# Altium schematic sheet PoE.SchDoc
size B
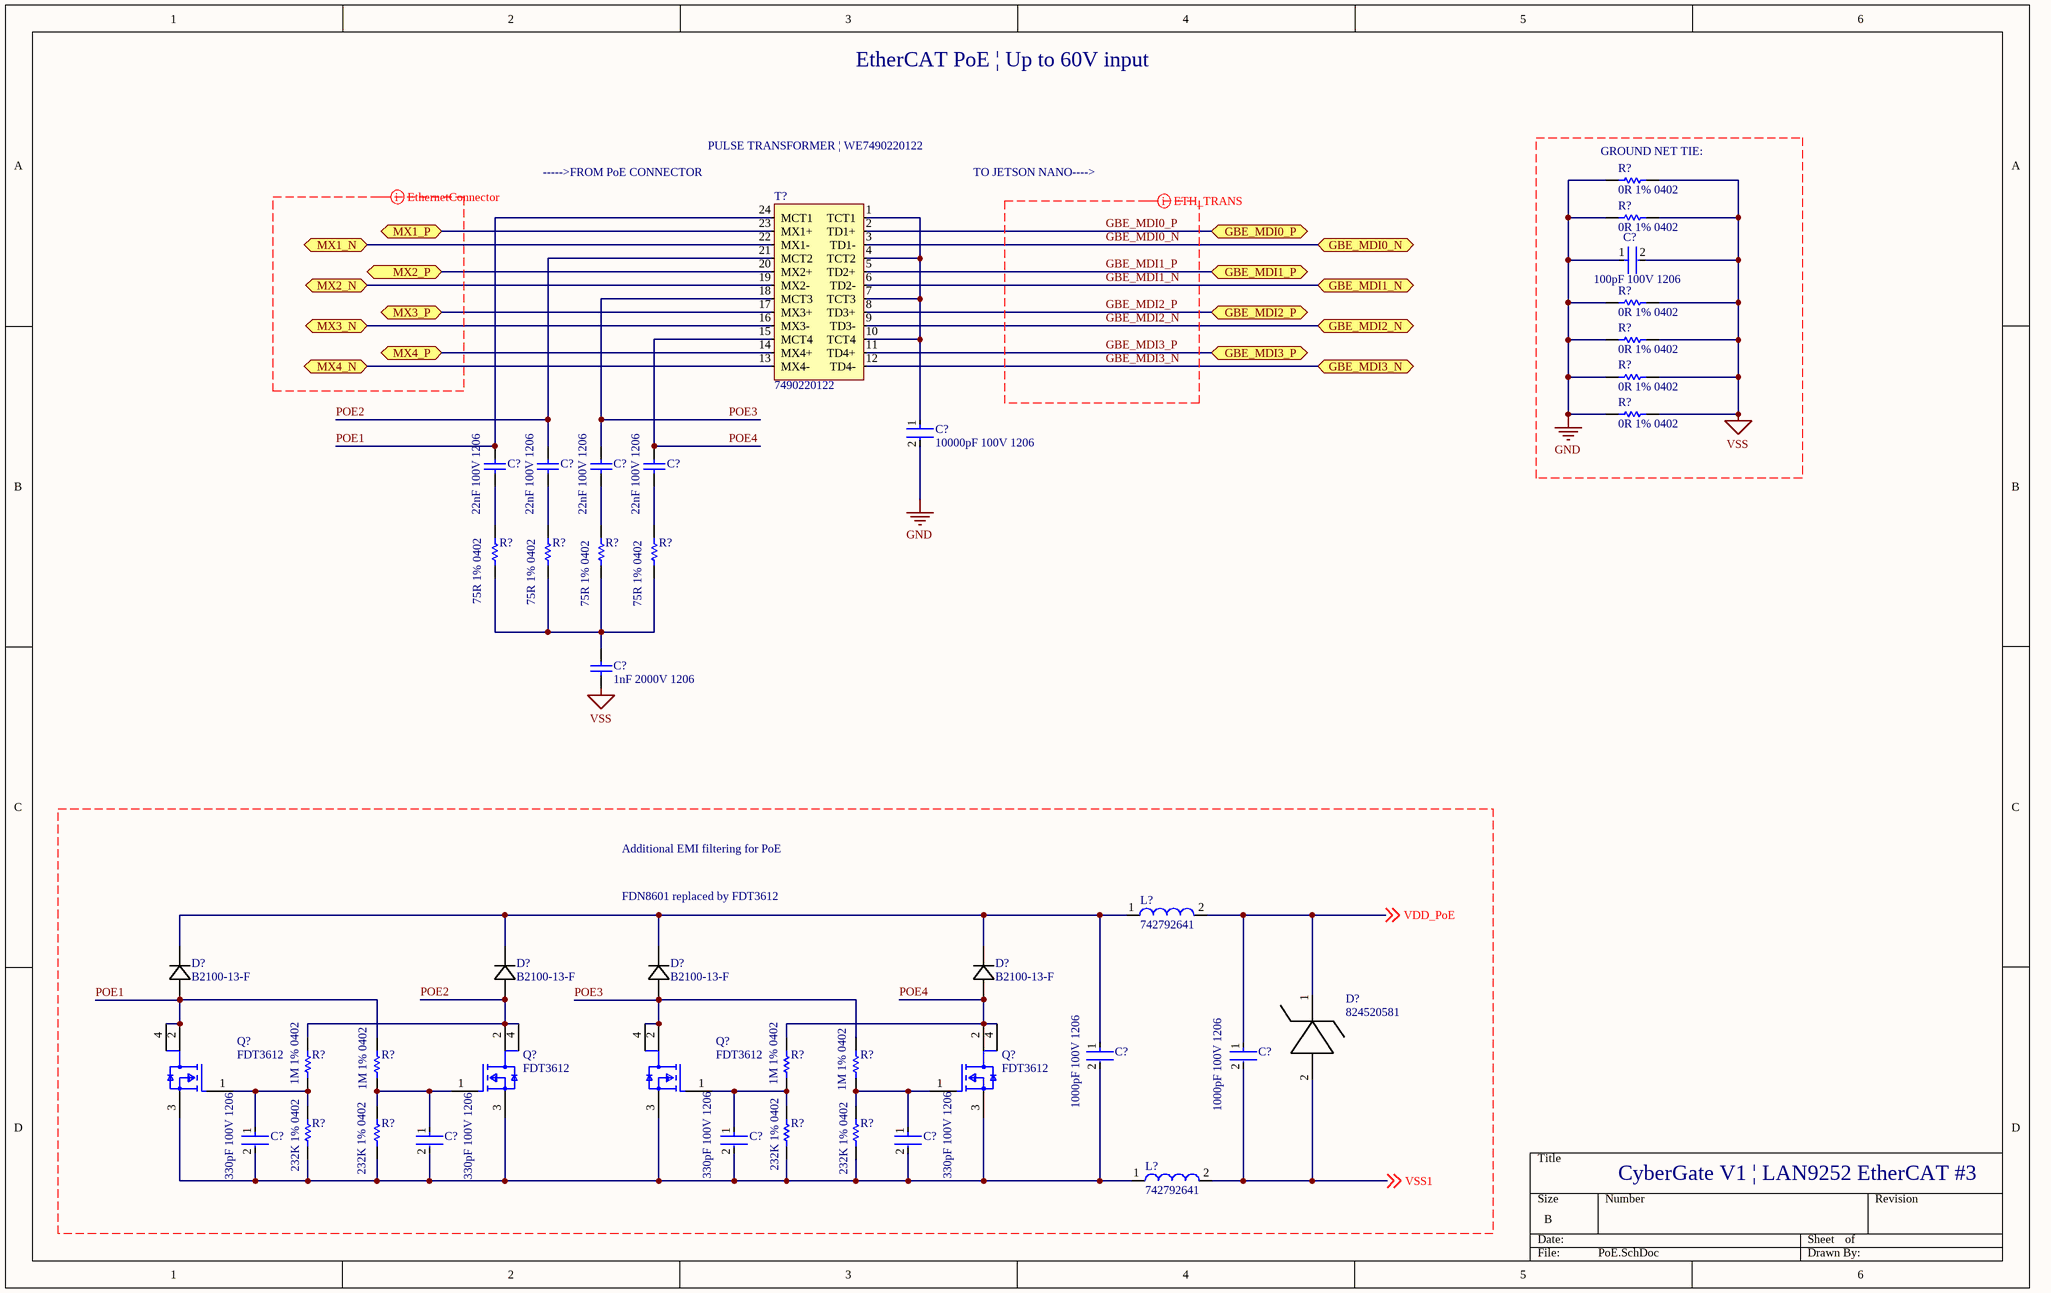
[diagram p0: PoE.SchDoc]

## Parts
(Parts that share a designator on the sheet are numbered #1, #2 ... from top to bottom, then left to right.)
C?#1  100pF 100V 1206  [FP-C1206C-EB-MFG]
C?#2  10000pF 100V 1206  [FP-C1206C-EB-MFG]
C?#3  22nF 100V 1206  [CAPC1206(3216)100_M]
C?#4  22nF 100V 1206  [CAPC1206(3216)100_M]
C?#5  22nF 100V 1206  [CAPC1206(3216)100_M]
C?#6  22nF 100V 1206  [CAPC1206(3216)100_M]
C?#7  1nF 2000V 1206  [JD-202R18W102KV4E-2_M]
C?#8  1000pF 100V 1206  [FP-C1206C-EB-MFG]
C?#9  1000pF 100V 1206  [FP-C1206C-EB-MFG]
C?#10  330pF 100V 1206  [FP-C1206C-EB-MFG]
C?#11  330pF 100V 1206  [FP-C1206C-EB-MFG]
C?#12  330pF 100V 1206  [FP-C1206C-EB-MFG]
C?#13  330pF 100V 1206  [FP-C1206C-EB-MFG]
D?#1  B2100-13-F  [B2100-13-f]
D?#2  B2100-13-F  [B2100-13-f]
D?#3  B2100-13-F  [B2100-13-f]
D?#4  B2100-13-F  [B2100-13-f]
D?#5  824520581  [824520581]
L?#1  742792641  [SMD-0603]
L?#2  742792641  [SMD-0603]
Q?#1  FDT3612  [FP-318H-IPC_C]
Q?#2  FDT3612  [FP-318H-IPC_C]
Q?#3  FDT3612  [FP-318H-IPC_C]
Q?#4  FDT3612  [FP-318H-IPC_C]
R?#1  0R 1% 0402  [RESC1005X40X25NL05T10]
R?#2  0R 1% 0402  [RESC1005X40X25NL05T10]
R?#3  0R 1% 0402  [RESC1005X40X25NL05T10]
R?#4  0R 1% 0402  [RESC1005X40X25NL05T10]
R?#5  0R 1% 0402  [RESC1005X40X25NL05T10]
R?#6  0R 1% 0402  [RESC1005X40X25NL05T10]
R?#7  75R 1% 0402  [RESC1005X35X25NL10T10]
R?#8  75R 1% 0402  [RESC1005X35X25NL10T10]
R?#9  75R 1% 0402  [RESC1005X35X25NL10T10]
R?#10  75R 1% 0402  [RESC1005X35X25NL10T10]
R?#11  1M 1% 0402  [RESC1005X40X25NL05T10]
R?#12  1M 1% 0402  [RESC1005X40X25NL05T10]
R?#13  1M 1% 0402  [RESC1005X40X25NL05T10]
R?#14  1M 1% 0402  [RESC1005X40X25NL05T10]
R?#15  232K 1% 0402  [RESC1005X40X25ML05T10]
R?#16  232K 1% 0402  [RESC1005X40X25ML05T10]
R?#17  232K 1% 0402  [RESC1005X40X25ML05T10]
R?#18  232K 1% 0402  [RESC1005X40X25ML05T10]
T?  7490220122  [7490220122]

## Ports
GBE_MDI0_N (bidir), GBE_MDI0_P (bidir), GBE_MDI1_N (bidir), GBE_MDI1_P (bidir), GBE_MDI2_N (bidir), GBE_MDI2_P (bidir), GBE_MDI3_N (bidir), GBE_MDI3_P (bidir), MX1_N (bidir), MX1_P (bidir), MX2_N (bidir), MX2_P (bidir), MX3_N (bidir), MX3_P (bidir), MX4_N (bidir), MX4_P (bidir)

## Nets
GND: C?#1.1 C?#2.2 R?#1.1 R?#2.1 R?#3.1 R?#4.1 R?#5.1 R?#6.1
VSS: C?#1.2 C?#7.1 R?#1.2 R?#2.2 R?#3.2 R?#4.2 R?#5.2 R?#6.2
GBE_MDI0_N: T?.3(TD1-) ; port GBE_MDI0_N
GBE_MDI0_P: T?.2(TD1+) ; port GBE_MDI0_P
GBE_MDI1_N: T?.6(TD2-) ; port GBE_MDI1_N
GBE_MDI1_P: T?.5(TD2+) ; port GBE_MDI1_P
GBE_MDI2_N: T?.9(TD3-) ; port GBE_MDI2_N
GBE_MDI2_P: T?.8(TD3+) ; port GBE_MDI2_P
GBE_MDI3_N: T?.12(TD4-) ; port GBE_MDI3_N
GBE_MDI3_P: T?.11(TD4+) ; port GBE_MDI3_P
MX1_N: T?.22(MX1-) ; port MX1_N
MX1_P: T?.23(MX1+) ; port MX1_P
MX2_N: T?.19(MX2-) ; port MX2_N
MX2_P: T?.20(MX2+) ; port MX2_P
MX3_N: T?.16(MX3-) ; port MX3_N
MX3_P: T?.17(MX3+) ; port MX3_P
MX4_N: T?.13(MX4-) ; port MX4_N
MX4_P: T?.14(MX4+) ; port MX4_P
POE1: C?#3.2 D?#1.2 Q?#1.2(D) Q?#1.4(D) R?#12.2 T?.24(MCT1)
POE2: C?#4.2 D?#2.2 Q?#2.2(D) Q?#2.4(D) R?#11.2 T?.21(MCT2)
POE3: C?#5.2 D?#3.2 Q?#3.2(D) Q?#3.4(D) R?#14.2 T?.18(MCT3)
POE4: C?#6.2 D?#4.2 Q?#4.2(D) Q?#4.4(D) R?#13.2 T?.15(MCT4)
VDD_PoE: C?#9.1 D?#5.1 L?#1.2 ; off-sheet VDD_PoE
VSS1: C?#9.2 D?#5.2 L?#2.2 ; off-sheet VSS1
NetC?#2_1: C?#2.1 T?.1(TCT1) T?.4(TCT2) T?.7(TCT3) T?.10(TCT4)
NetC?#3_1: C?#3.1 R?#7.2
NetC?#4_1: C?#4.1 R?#8.2
NetC?#5_1: C?#5.1 R?#9.2
NetC?#6_1: C?#6.1 R?#10.2
NetC?#7_2: C?#7.2 R?#7.1 R?#8.1 R?#9.1 R?#10.1
NetC?#8_1: C?#8.1 D?#1.1 D?#2.1 D?#3.1 D?#4.1 L?#1.1
NetC?#8_2: C?#8.2 C?#10.2 C?#11.2 C?#12.2 C?#13.2 L?#2.1 Q?#1.3(S) Q?#2.3(S) Q?#3.3(S) Q?#4.3(S) R?#15.1 R?#16.1 R?#17.1 R?#18.1
NetC?#10_1: C?#10.1 Q?#1.1(G) R?#11.1 R?#15.2
NetC?#11_1: C?#11.1 Q?#2.1(G) R?#12.1 R?#16.2
NetC?#12_1: C?#12.1 Q?#3.1(G) R?#13.1 R?#17.2
NetC?#13_1: C?#13.1 Q?#4.1(G) R?#14.1 R?#18.2

## Layout directives
differential pair; differential pair class ETH_TRANS_LINES; net class ETH_TRANS; rule Differential Pairs Routing [Pref Gap = 0.254mm    Min Gap  = 0.127mm    Max Gap  = 0.254mmPref Width = 0.254mm    Min Width  = 0.127mm    Max Width  = 0.254mm]: GBE_MDI0_N, GBE_MDI0_P, GBE_MDI1_N, GBE_MDI1_P, GBE_MDI2_N, GBE_MDI2_P, GBE_MDI3_N, GBE_MDI3_P
differential pair; differential pair class ETH_CONNECTOR_LINES; net class EthernetConnector; rule Differential Pairs Routing [Pref Gap = 0.254mm    Min Gap  = 0.127mm    Max Gap  = 0.254mmPref Width = 0.254mm    Min Width  = 0.127mm    Max Width  = 0.254mm]: (no net found under the mark)

## Notes on the sheet
- EtherCAT PoE | Up to 60V input
- PULSE TRANSFORMER | WE7490220122
- (near R?#1) GROUND NET TIE:
- ----->FROM PoE CONNECTOR
- TO JETSON NANO---->
- FDN8601 replaced by FDT3612
- Additional EMI filtering for PoE
- CyberGate V1 | LAN9252 EtherCAT #3

## Library data of the parts
C?#1 = CMP-03020-011698-1: CAP CER 100PF 100V C0G/NP0 1206; Manufacturer: KEMET; Manufacturer Part Number: C1206C101J1GACTU; Temperature Characteristic: C0G; Temperature Coefficient: 15%; Tolerance: 0.05; Automotive Grade: Grade 0; Material: Ceramic; Temperature Range Low: -55°C; Device Class L3: Ceramic Capacitors; Temperature: -55°C to +150°C; Value: 100 pF; Capacitance: 100 pF; ComponentLink2URL: https://content.kemet.com/datasheets/KEM_C1007_X8R_ULTRA_150C_SMD.pdf; Ipc Land Pattern Name: CAPC320160X78; Mouser Description: Multilayer Ceramic Capacitors MLCC - SMD/SMT 100volts 100pF C0G 5%; Automotive: Yes; Voltage Rating: 100 V; Octopart: https://octopart.com/c1206c101j1gactu-kemet-98729; Height: 0.88mm; RoHS: TRUE; Lead Free: Yes; Device Class L1: Passive Components; Package: C1206C-EB; Digikey Description: CAP CER 100PF 100V C0G/NP0 1206; ComponentLink2Description: Datasheet; Temperature Range High: +150°C; Category: Cap; Device Class L2: Capacitors
C?#2 = CMP-03020-003656-1: CAP CER 10000PF 100V X7R 1206; Manufacturer: KEMET; Manufacturer Part Number: C1206C103J1RACTU; Temperature Coefficient: 15%; Capacitance: 10,000 pF; Automotive Grade: Grade 0; Value: 10,000 pF; Material: Ceramic; Tolerance: 0.05; Digikey Description: CAP CER 10000PF 100V X7R 1206; Temperature Range Low: -55°C; Height: 0.88mm; Automotive: Yes; Ipc Land Pattern Name: CAPC320160X78; ComponentLink2URL: https://content.kemet.com/datasheets/KEM_C1007_X8R_ULTRA_150C_SMD.pdf; Device Class L2: Capacitors; Mouser Description: 1206 C 10nF Ceramic Multilayer Capacitor, 100 VDC, +125degC, X7R Dielec, +/-5%; Octopart: https://octopart.com/c1206c103j1ractu-kemet-121270; Category: Cap; Temperature Characteristic: X7R; Voltage Rating: 100 V; Temperature: -55°C to +150°C; Device Class L1: Passive Components; RoHS: TRUE; Device Class L3: Ceramic Capacitors; Package: C1206C-EB; Lead Free: Yes; ComponentLink2Description: Datasheet; Temperature Range High: +150°C
C?#3-C?#6 = CMP-1037-03774-1: CAP 22nF 100V ±5% 1206 (3216 Metric) Thickness 1mm SMD; Tolerance: Â±5%; Case-Metric: 3216; Case-EIA: 1206; Value: 22nF; Rated Voltage: 100 V; Technology: SMT; Max Thickness: 1 mm
C?#7 = CMP-2000-05161-1: Chip Capacitor, 1 nF, +/- 10%, 2000 V, -55 to 125 degC, 1206 (3216 Metric), RoHS, Tape and Reel; Manufacturer: Johanson Dielectrics; Voltage Rating DC: 2kV; Brand: JohansonDielectrics; Case Length: 3.15mm; Type: HighVoltageCapacitors; Dielectric: X7R; Case Width: 1.6mm; Capacitance: 1000pF; Class: 2; Case Height: 1.27mm; Case Code - mm: 3216; Package / Case: 1206(3216metric); Case Code - in: 1206; Manufacturer URL: http://www.johansondielectrics.com; Tolerance: 10%; Minimum Operating Temperature: -55C; Termination Style: SMD/SMT; Datasheet Version: Apr-07; RoHS: Details; Factory Pack Quantity: 3000; Datasheet URL: http://www.farnell.com/datasheets/87135.pdf; Product Category: MultilayerCeramicCapacitorsMLCC-SMD/SMT; Maximum Operating Temperature: +125C; Product: GeneralTypeMLCCs; Packaging: Reel
C?#8 C?#9 = CMP-03020-000955-1: Multilayer Ceramic Capacitor, C Series, 1000 Pf, - 5%, C0g / Np0, 100 V, 1206 [3216 Metric] Rohs Compliant: Yes; Manufacturer: KEMET; Manufacturer Part Number: C1206C102J1GACTU; Capacitance: 1,000 pF; Tolerance: 0.05; Automotive Grade: Grade 0; Temperature Coefficient: 15%; Value: 1,000 pF; Material: Ceramic; Ipc Land Pattern Name: CAPC320160X78; Voltage Rating: 100 V; Octopart: https://octopart.com/c1206c102j1gactu-kemet-99808; Height: 0.88mm; Device Class L3: Ceramic Capacitors; Digikey Description: Multilayer Ceramic Capacitor, C Series, 1000 Pf, - 5%, C0g / Np0, 100 V, 1206 [3216 Metric] Rohs Compliant: Yes; Package: C1206C-EB; Temperature: -55°C to +150°C; Category: Cap; Temperature Range High: +150°C; ComponentLink2Description: Datasheet; RoHS: TRUE; Temperature Range Low: -55°C; Device Class L1: Passive Components; Device Class L2: Capacitors; Lead Free: Yes; Automotive: Yes; ComponentLink2URL: https://content.kemet.com/datasheets/KEM_C1007_X8R_ULTRA_150C_SMD.pdf; Mouser Description: Multilayer Ceramic Capacitors MLCC - SMD/SMT 100volts 1000pF C0G 5%; Temperature Characteristic: C0G
C?#10-C?#13 = CMP-03020-031320-1: CAP CER 330PF 100V 5% NP0 1206; Manufacturer: KEMET; Manufacturer Part Number: C1206C331J1GACTU; Material: Ceramic; Temperature Coefficient: 15%; Automotive Grade: Grade 0; Tolerance: 0.05; Temperature Characteristic: C0G; Digikey Description: CAP CER 330PF 100V 5% NP0 1206; Device Class L1: Passive Components; Height: 0.88mm; Temperature Range Low: -55°C; Automotive: Yes; RoHS: TRUE; Category: Cap; Ipc Land Pattern Name: CAPC320160X78; ComponentLink2Description: Datasheet; Value: 330 pF; Device Class L2: Capacitors; Voltage Rating: 100 V; Temperature Range High: +150°C; Octopart: https://octopart.com/c1206c331j1gactu-kemet-9143110; Mouser Description: 1206 330pF Ceramic Multilayer Capacitor; 100VDC; 125degC; C0G Dielec; +/-5% SMD; Package: C1206C-EB; Device Class L3: Ceramic Capacitors; Capacitance: 330 pF; Temperature: -55°C to +150°C; Lead Free: Yes; ComponentLink2URL: https://content.kemet.com/datasheets/KEM_C1007_X8R_ULTRA_150C_SMD.pdf
D?#1-D?#4 = B2100-13-F: No Description Available; Vendor: Diodes Inc; Built_By: EMA_UL_Team; SourceLibrary: DiodesInc_2015-05-08; Type: DEV; Manufacturer_Part_Number: B2100-13-F; Copyright: Copyright (C) 2018 Accelerated Designs. All rights reserved; RefDes: RefDes; Value: Value
D?#5 = 824520581: 93.6V Clamp 6.5A Ipp Tvs Diode Surface Mount DO-214AA
L?#1 L?#2 = CMP-0220-00171-1: SMD EMI Suppression Ferrite Bead WE-CBF, Z = 300 Ohm; Impedance: 300 Ohm; PackageReference: SMD-0603; PackageVersion: 2009; ComponentLink2Description: Datasheet; ComponentLink2URL: http://www.we-online.de/katalog/media/pdf/742792641.pdf; ComponentLink1Description: Manufacturer Link; ComponentLink1URL: http://www.we-online.com; DatasheetVersion: Dec-2005; PackageDescription: Chip Inductor, 2-Leads, Body 1.6 x 0.8 mm
Q?#1-Q?#4 = CMP-07173-000002-1: MOSFET N-CH 100V 3.7A SOT-223; Manufacturer: ON Semiconductor; Max Forward Diode Voltage: 1.2V; Input Capacitace At Vds: 632pF @ 50V; Transconductance: 11S; Number Of Channels: 1; Typ Forward Diode Voltage: 0.75V; Turn Off Delay Time: 23ns; Max Junction Temp: +150°C; Drain To Source Resistance: 88mΩ; Pulse Drain Current: 20A; Gate To Source Voltage: 20V; Threshold Vgs Min: 2V; Threshold Vgs Max: 4V; Depletion Mode: False; Gate Charge At Vgs: 14nC @ 10V; Rthja Max: 42°C/W; Standoff Height: 0.02mm; Power Dissipation: 1.1W; Turn On Delay Time: 8.5ns; Drain To Source Breakdown Voltage: 100V; Device Class L3: MOSFETs; Manufacturer Part Number: FDT3612; Package: 318H; Device Class L1: Discrete Semiconductors; Device Class L2: Transistors; Footprint Url: https://www.onsemi.com/pub/Collateral/318H-01.PDF; Temperature Range High: +150°C; Temperature: -55°C to +150°C; Ipc Land Pattern Name: SOT230P700X180-4; Category: Trans; Drain To Source Voltage: 100V; Number Of N Channels: 1; ComponentLink2Description: Datasheet; Automotive: No; Octopart: https://octopart.com/fdt3612-on+semiconductor-84326694; Height: 1.8mm; RoHS: TRUE; Temperature Range Low: -55°C; ComponentLink2URL: https://www.onsemi.com/pub/Collateral/FDT3612-D.PDF; Lead Free: Yes; Digikey Description: MOSFET N-CH 100V 3.7A SOT-223; Continuous Drain Current: 3.7A; Mouser Description: N-Channel 100 V 120 mOhm SMT PowerTrench Mosfet- SOT-223
R?#1-R?#6 = CMP-2002-07912-1: Manufacturer: Yageo / Phycomp; Part Number: RC0402JR-070RL
R?#7-R?#10 = CMP-2002-02817-1: Manufacturer: Yageo; Part Number: RT0402BRD0775RL
R?#11-R?#14 = CMP-2002-07947-1: Part Number: RC0402JR-071ML; Manufacturer: Yageo / Phycomp
R?#15-R?#18 = CMP-2002-07521-1: Part Number: RC0402FR-07232KL; Manufacturer: Yageo
T? = 7490220122: 350µH LAN 10/100/1000 Base-T Pulse Transformer 1CT:1CT Transmitter, 1CT:1CT Receiver Surface Mount